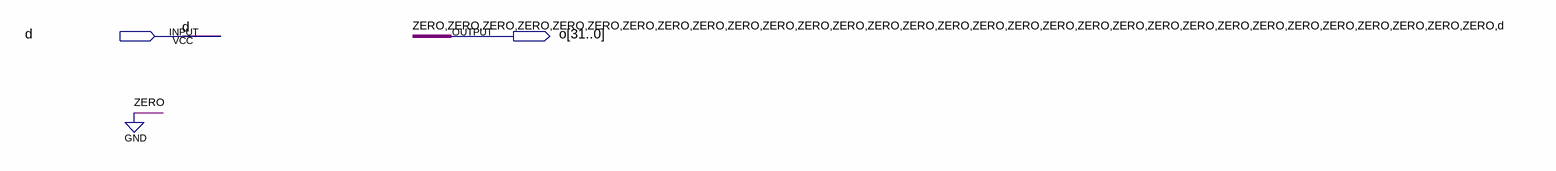
[diagram p0: schematic sheet]
// Quartus schematic ZEXT1_32.bdf as structural Verilog: 0 symbols, 2 pins
module ZEXT1_32 (
  input  d,
  output [31:0] o
);


  assign o = {{31{1'b0}}, d};
endmodule
